# EAGLE design pm3_RF_dev (EAGLE 5.11)

## Sheet 1 of 4
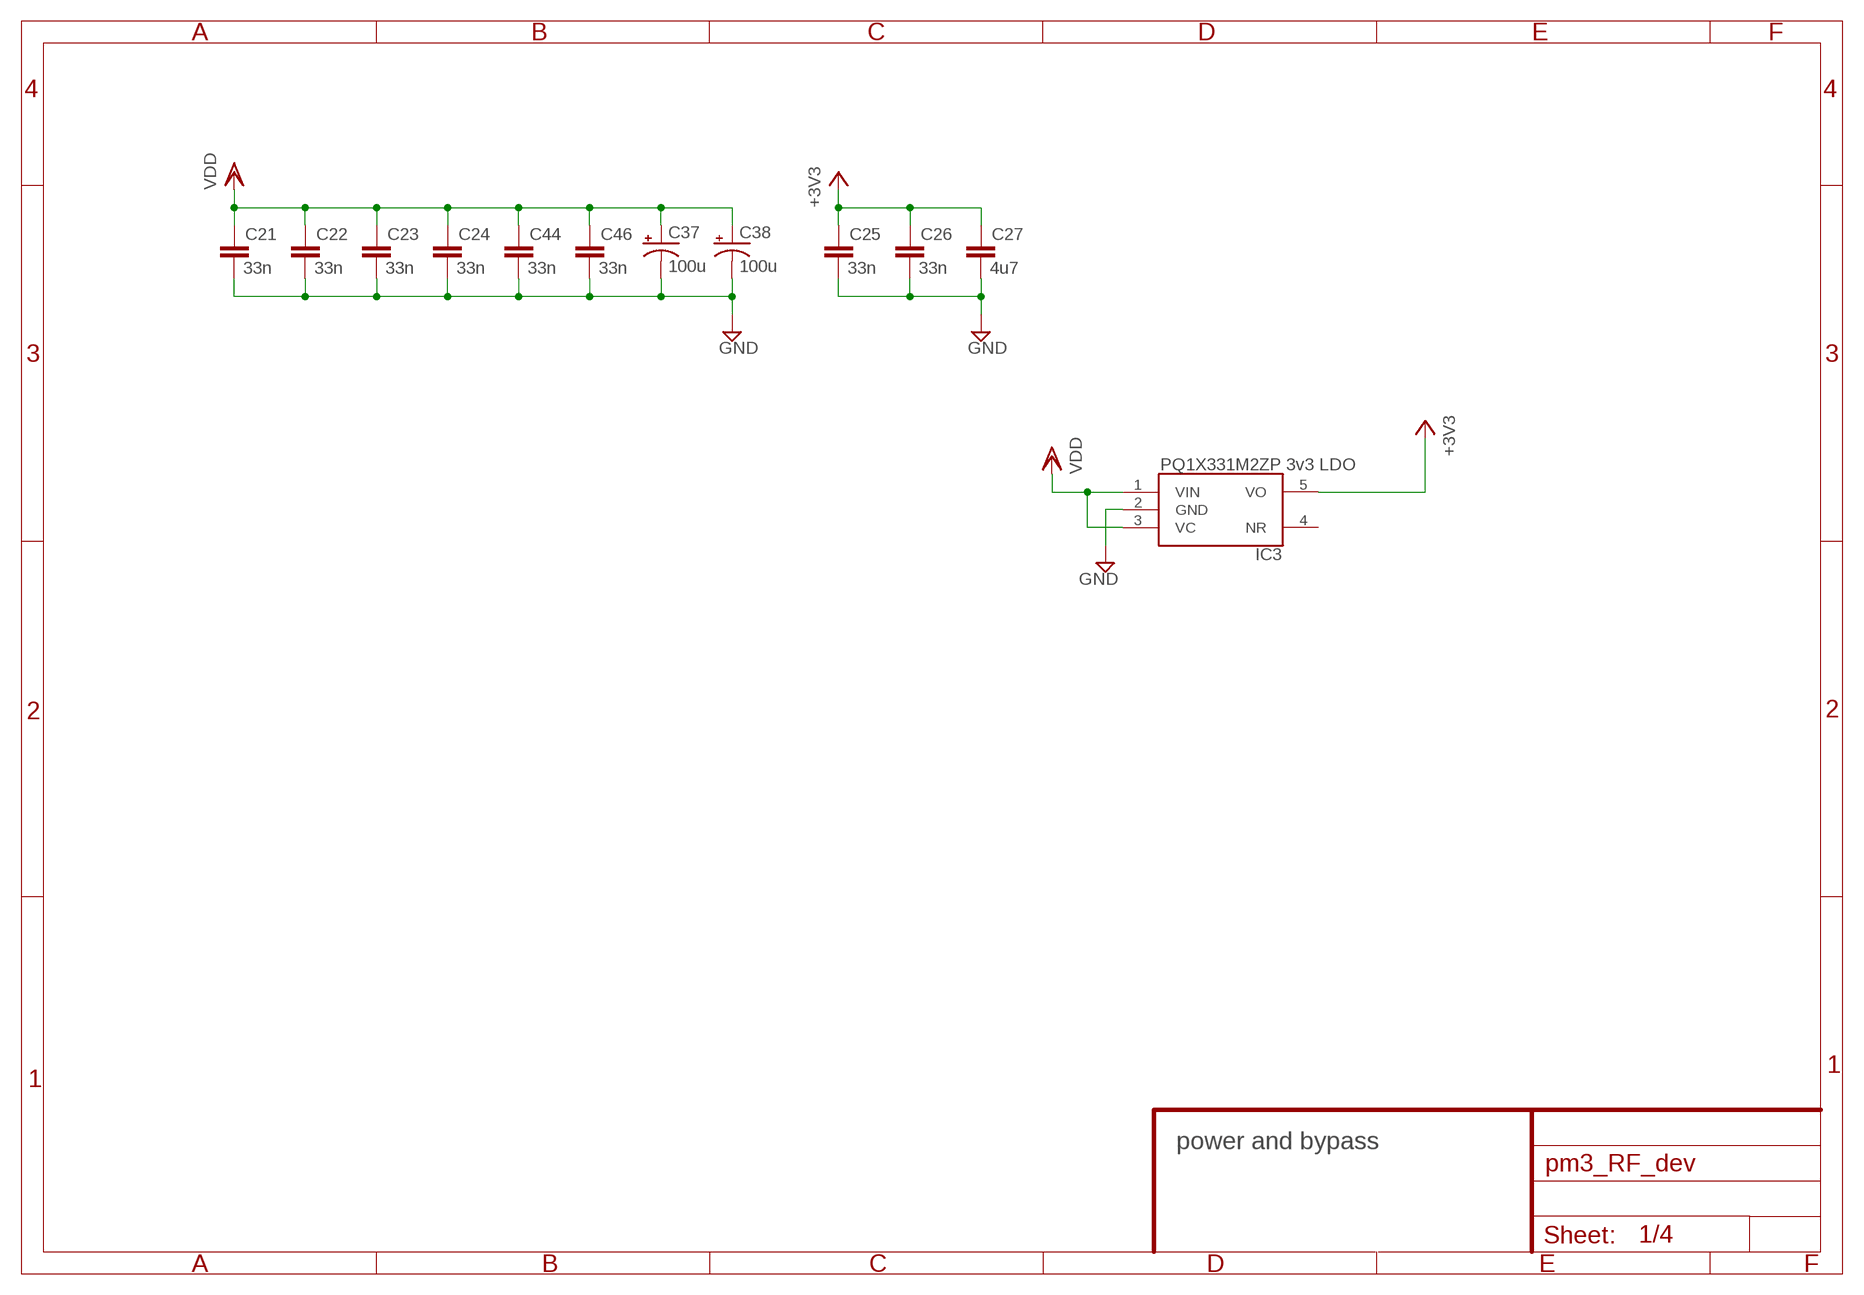
[diagram p0: schematic, sheet 1]

### Parts
C21  33n  CAPACITOR0603  [RLC_0603]
C22  33n  CAPACITOR0603  [RLC_0603]
C23  33n  CAPACITOR0603  [RLC_0603]
C24  33n  CAPACITOR0603  [RLC_0603]
C25  33n  CAPACITOR0603  [RLC_0603]
C26  33n  CAPACITOR0603  [RLC_0603]
C27  4u7  CAPACITOR1210  [RLC_1210]
C37  100u  CAPACITOR-POLARIZEDALCHIP-MZA-F80  [CAPCAITOR-ELECTROLYTIC-ALCHIP-MZA-F80]
C38  100u  CAPACITOR-POLARIZEDALCHIP-MZA-F80  [CAPCAITOR-ELECTROLYTIC-ALCHIP-MZA-F80]
C44  33n  CAPACITOR0603  [RLC_0603]
C46  33n  CAPACITOR0603  [RLC_0603]
IC3  PQ1X331M2ZP-3V3-LDO-SOT-23-5  [SOT-23-5]

### Nets
+3V3: C25.1 C26.1 C27.1 IC3.5(VO) ; also sheet 2
GND: C21.2 C22.2 C23.2 C24.2 C25.2 C26.2 C27.2 C37.- C38.- C44.2 C46.2 IC3.2(GND) ; also sheet 2,3,4
VDD: C21.1 C22.1 C23.1 C24.1 C37.+ C38.+ C44.1 C46.1 IC3.1(VIN) IC3.3(VC) ; also sheet 2,3,4
Unconnected: IC3.4(NR)

### Notes on the sheet
- power and bypass

## Sheet 2 of 4
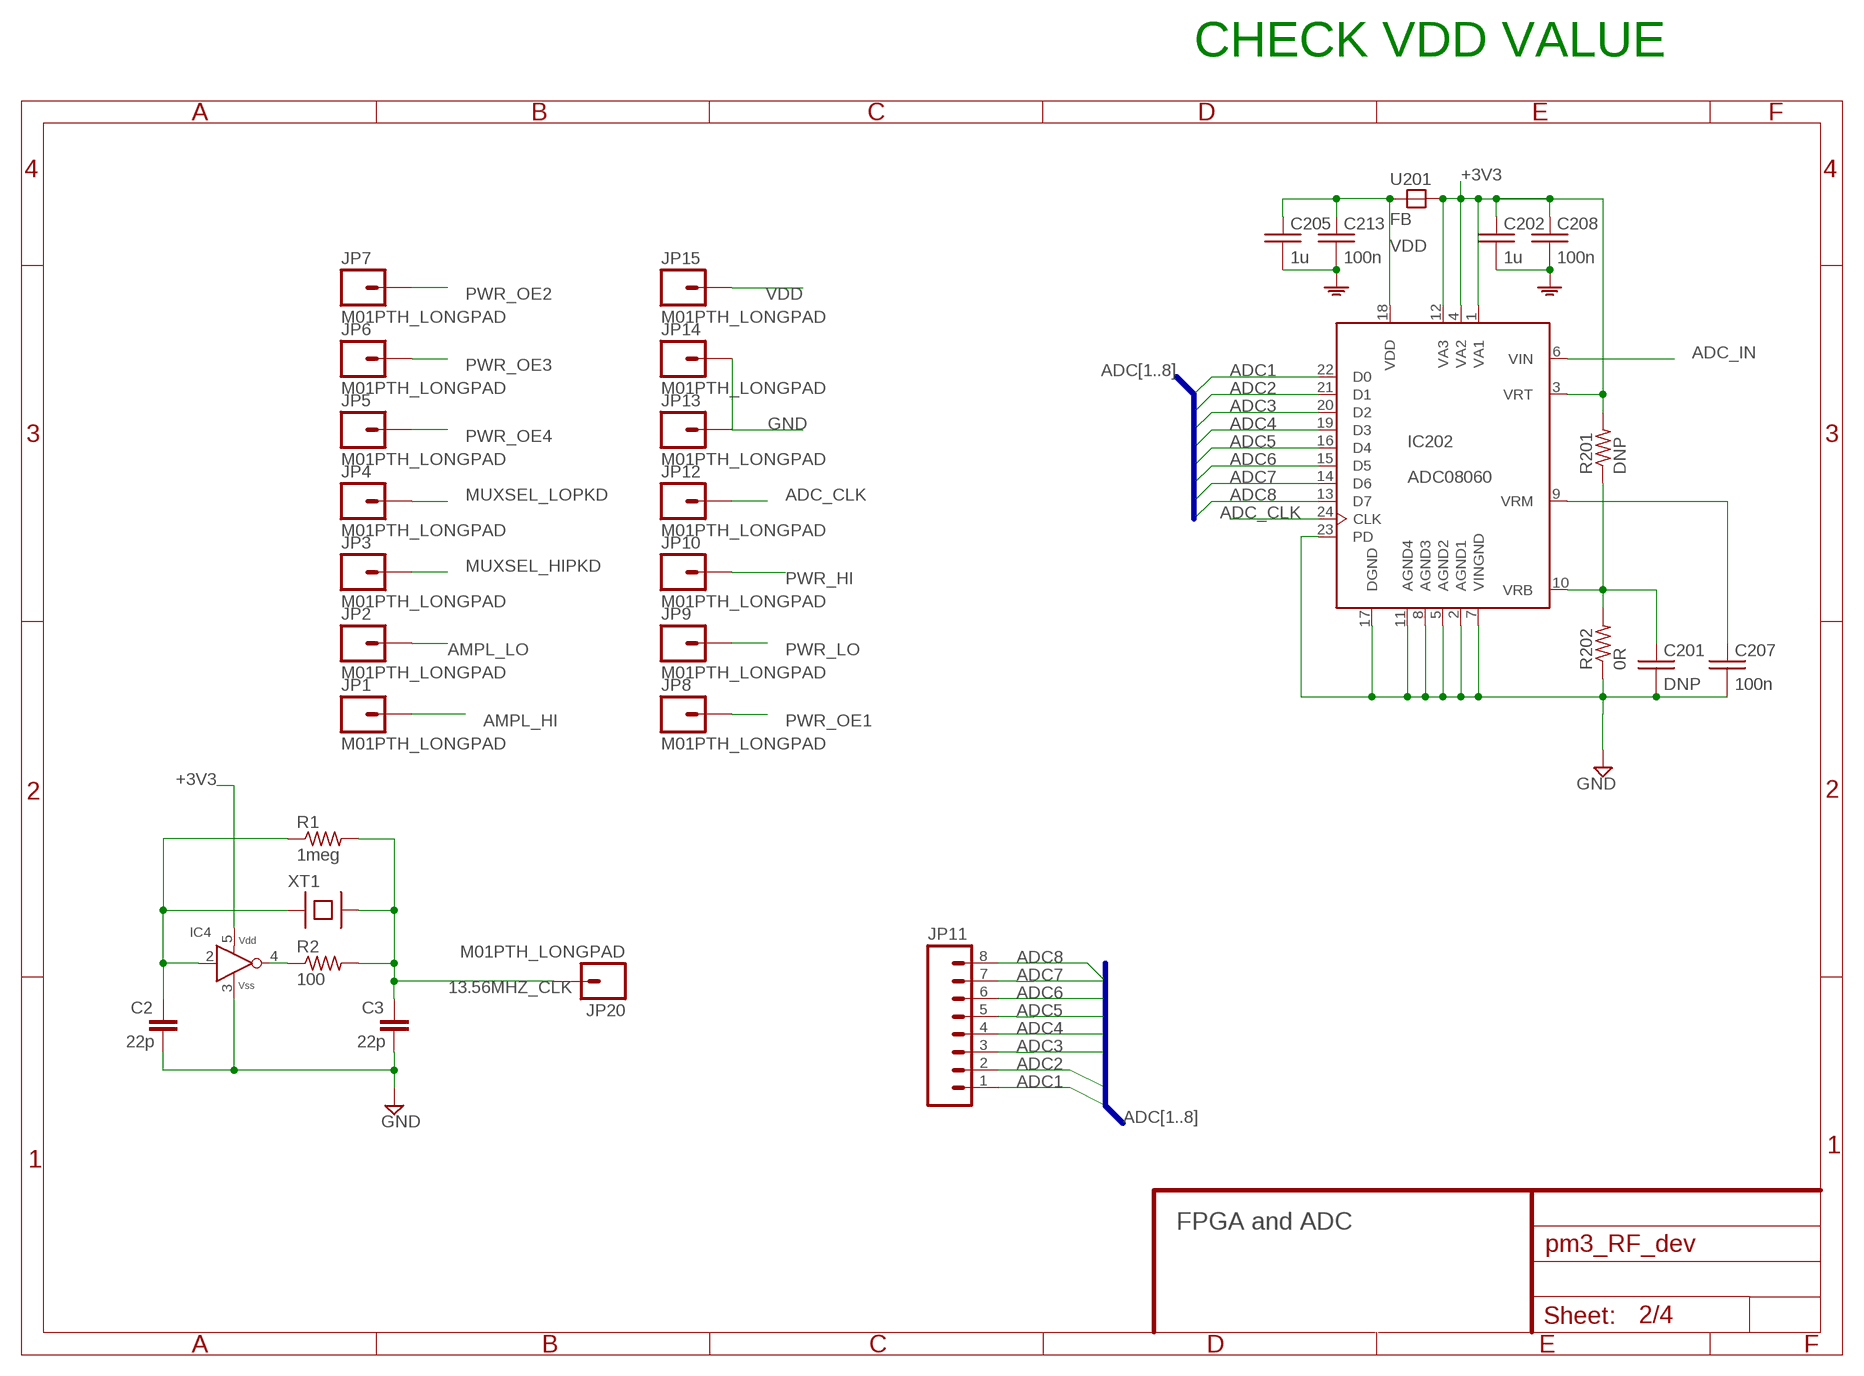
[diagram p1: schematic, sheet 2]

### Parts
C2  22p  CAPACITOR0603  [RLC_0603]
C3  22p  CAPACITOR0603  [RLC_0603]
C201  DNP  C-EU  [0603]
C202  1u  C-EU  [0603]
C205  1u  C-EU  [0603]
C207  100n  C-EU  [0603]
C208  100n  C-EU  [0603]
C213  100n  C-EU  [0603]
IC4  HCU-INVERTER  [SMV-5]
IC202  ADC08060  [TSSOP24]
JP1  M01PTH_LONGPAD  [1X01_LONGPAD]
JP2  M01PTH_LONGPAD  [1X01_LONGPAD]
JP3  M01PTH_LONGPAD  [1X01_LONGPAD]
JP4  M01PTH_LONGPAD  [1X01_LONGPAD]
JP5  M01PTH_LONGPAD  [1X01_LONGPAD]
JP6  M01PTH_LONGPAD  [1X01_LONGPAD]
JP7  M01PTH_LONGPAD  [1X01_LONGPAD]
JP8  M01PTH_LONGPAD  [1X01_LONGPAD]
JP9  M01PTH_LONGPAD  [1X01_LONGPAD]
JP10  M01PTH_LONGPAD  [1X01_LONGPAD]
JP11  M08LONGPADS  [1X08_LONGPADS]
JP12  M01PTH_LONGPAD  [1X01_LONGPAD]
JP13  M01PTH_LONGPAD  [1X01_LONGPAD]
JP14  M01PTH_LONGPAD  [1X01_LONGPAD]
JP15  M01PTH_LONGPAD  [1X01_LONGPAD]
JP20  M01PTH_LONGPAD  [1X01_LONGPAD]
R1  1meg  RESISTOR0603  [RLC_0603]
R2  100  RESISTOR0603  [RLC_0603]
R201  DNP  R-US  [0603]
R202  0R  R-US  [0603]
U201  FB  [0805]
XT1  XTAL-SMD-CITIZEN-CS10  [XTAL-SMD-CITIZEN-CS10]

### Nets
13.56MHZ_CLK: C3.1 JP20.1 R1.2 R2.2 XT1.B
+3V3: C202.1 C208.1 IC4.5(VDD) IC202.1(VA1) IC202.3(VRT) IC202.4(VA2) IC202.12(VA3) R201.2 U201.2(B) ; also sheet 1
ADC1: IC202.22(D0) JP11.1
ADC2: IC202.21(D1) JP11.2
ADC3: IC202.20(D2) JP11.3
ADC4: IC202.19(D3) JP11.4
ADC5: IC202.16(D4) JP11.5
ADC6: IC202.15(D5) JP11.6
ADC7: IC202.14(D6) JP11.7
ADC8: IC202.13(D7) JP11.8
ADC_CLK: IC202.24(CLK) JP12.1
ADC_IN: IC202.6(VIN) ; also sheet 3
AMPL_HI: JP1.1 ; also sheet 3
AMPL_LO: JP2.1 ; also sheet 3
GND: C2.2 C3.2 C202.2 C205.2 C208.2 C213.2 IC4.3(VSS) JP13.1 JP14.1 ; supply symbol labelled AGND ; also sheet 1,3,4
MUXSEL_HIPKD: JP3.1 ; also sheet 3
MUXSEL_LOPKD: JP4.1 ; also sheet 3
N$3: IC4.4(Y) R2.1
N$4: C2.1 IC4.2(A) R1.1 XT1.A
N$23: C201.1 IC202.10(VRB) R201.1 R202.2
N$24: C201.2 C207.2 IC202.2(AGND1) IC202.5(AGND2) IC202.7(VINGND) IC202.8(AGND3) IC202.11(AGND4) IC202.17(DGND) IC202.23(PD) R202.1
N$26: C207.1 IC202.9(VRM)
PWR_HI: JP10.1 ; also sheet 4
PWR_LO: JP9.1 ; also sheet 4
PWR_OE1: JP8.1 ; also sheet 4
PWR_OE2: JP7.1 ; also sheet 4
PWR_OE3: JP6.1 ; also sheet 4
PWR_OE4: JP5.1 ; also sheet 4
VDD: C205.1 C213.1 IC202.18(VDD) JP15.1 U201.1(A) ; also sheet 1,3,4

### Buses
ADC[1..8]

### Notes on the sheet
- CHECK VDD VALUE
- FPGA and ADC

## Sheet 3 of 4
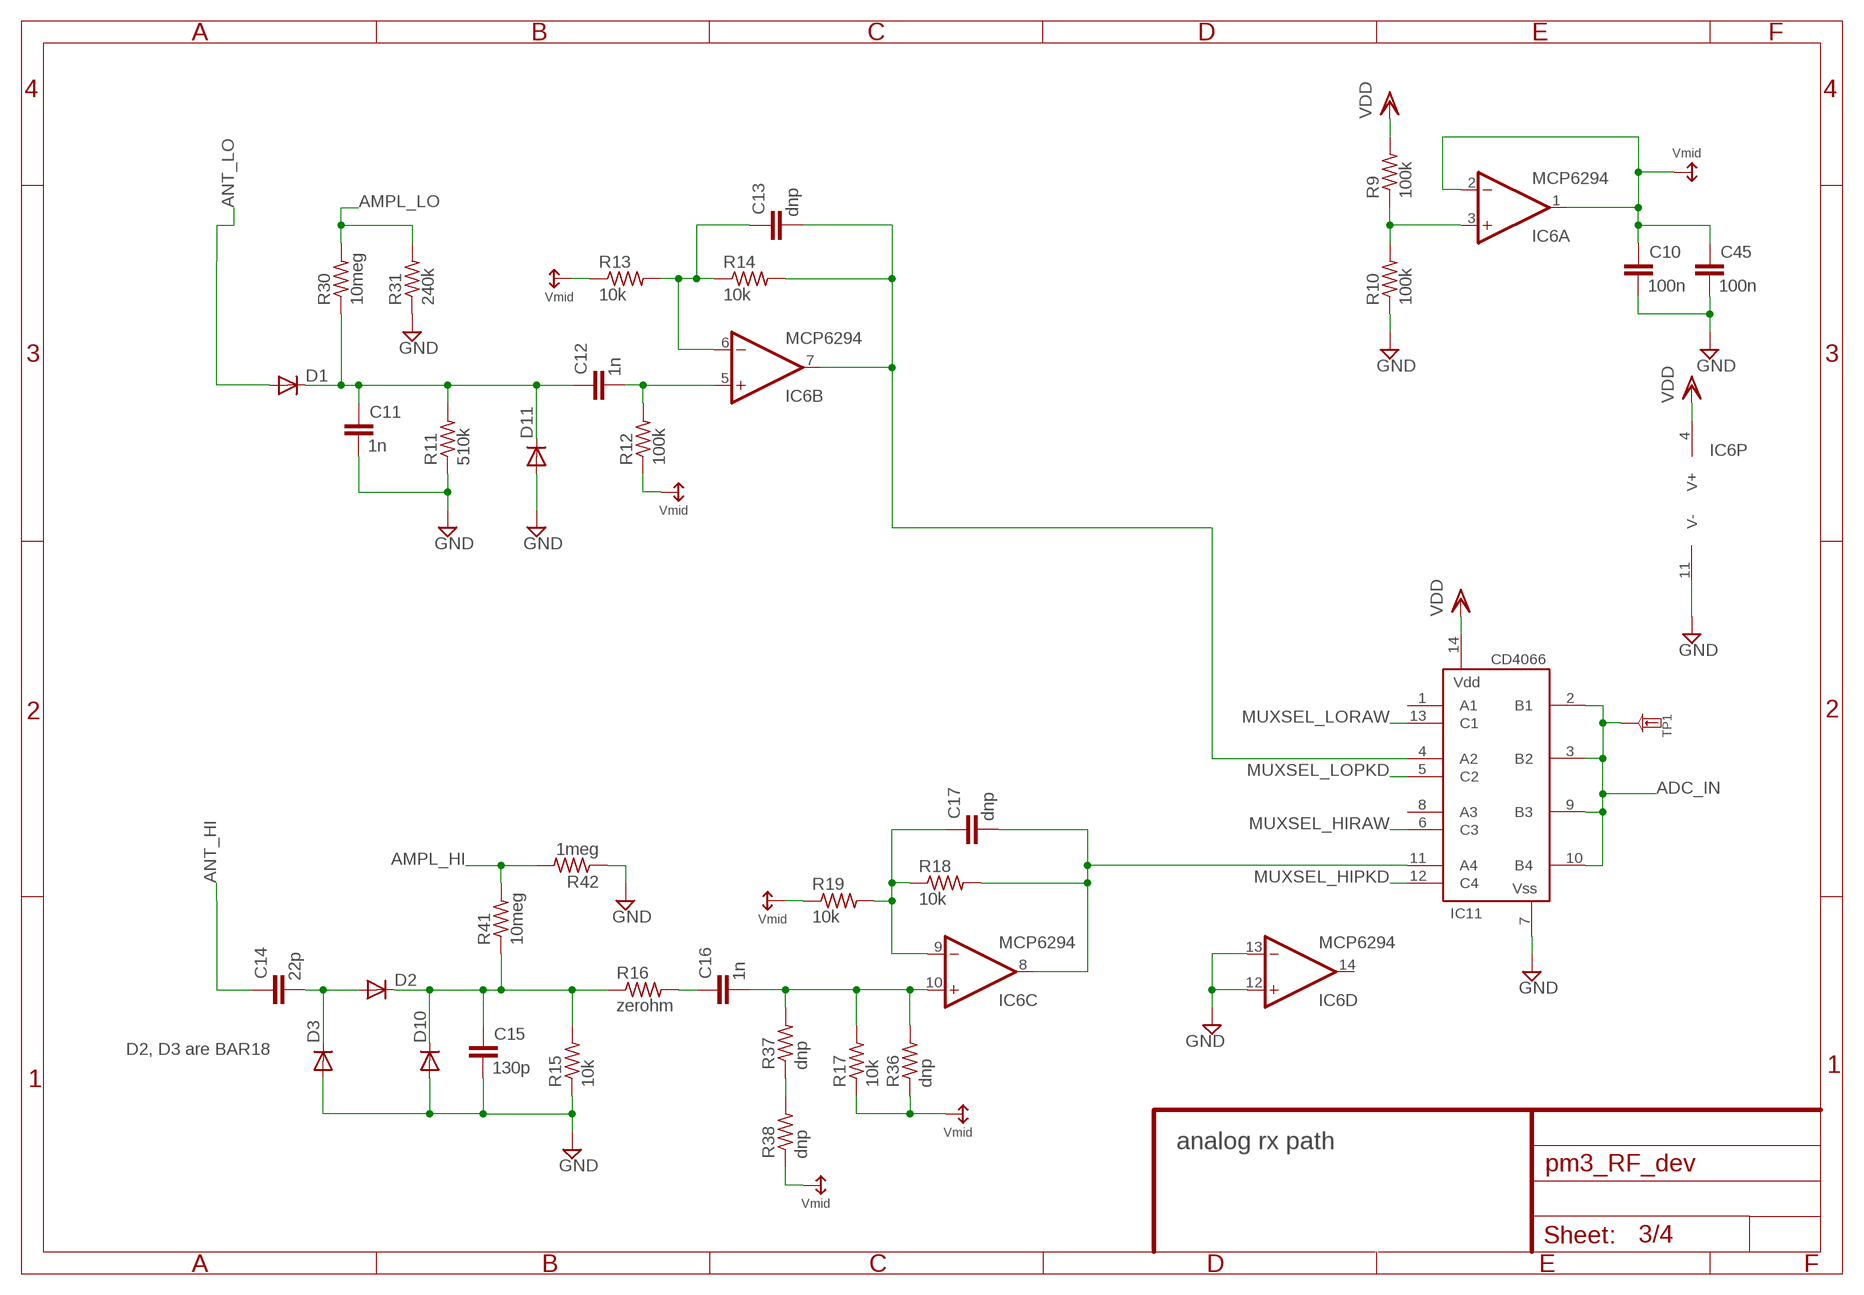
[diagram p2: schematic, sheet 3]

### Parts
C10  100n  CAPACITOR0603  [RLC_0603]
C11  1n  CAPACITOR0603  [RLC_0603]
C12  1n  CAPACITOR0603  [RLC_0603]
C13  dnp  CAPACITOR0603  [RLC_0603]
C14  22p  CAPACITOR0603  [RLC_0603]
C15  130p  CAPACITOR0603  [RLC_0603]
C16  1n  CAPACITOR0603  [RLC_0603]
C17  dnp  CAPACITOR0603  [RLC_0603]
C45  100n  CAPACITOR0603  [RLC_0603]
D1  DIODE-SMD-SOT23  [SOT23-3LEAD]
D2  DIODE-SMD-SOT23  [SOT23-3LEAD]
D3  DIODE-SMD-SOT23  [SOT23-3LEAD]
D10  DIODE-SMD-SOT23  [SOT23-3LEAD]
D11  DIODE-SMD-SOT23  [SOT23-3LEAD]
IC6  MCP6294  OPAMP-TLC2274  [TSSOP-14]
IC11  CD4066  [TSSOP-14]
R9  100k  RESISTOR0603  [RLC_0603]
R10  100k  RESISTOR0603  [RLC_0603]
R11  510k  RESISTOR0603  [RLC_0603]
R12  100k  RESISTOR0603  [RLC_0603]
R13  10k  RESISTOR0603  [RLC_0603]
R14  10k  RESISTOR0603  [RLC_0603]
R15  10k  RESISTOR0603  [RLC_0603]
R16  zerohm  RESISTOR0603  [RLC_0603]
R17  10k  RESISTOR0603  [RLC_0603]
R18  10k  RESISTOR0603  [RLC_0603]
R19  10k  RESISTOR0603  [RLC_0603]
R30  10meg  RESISTOR0603  [RLC_0603]
R31  240k  RESISTOR0603  [RLC_0603]
R36  dnp  RESISTOR0603  [RLC_0603]
R37  dnp  RESISTOR0603  [RLC_0603]
R38  dnp  RESISTOR0603  [RLC_0603]
R41  10meg  RESISTOR0603  [RLC_0603]
R42  1meg  RESISTOR0603  [RLC_0603]
TP1  TESTPADKEYSTONE-SMD  [KEYSTONE-SMD-TESTPOINT-5015]

### Nets
ADC_IN: IC11.2(B1) IC11.3(B2) IC11.9(B3) IC11.10(B4) TP1.1 ; also sheet 2
ADCDR_HI: C17.2 IC6.8(C:OUT) IC11.11(A4) R18.2
ADCDR_LO: C13.2 IC6.7(B:OUT) IC11.4(A2) R14.2
AMPL_HI: R41.2 R42.2 ; also sheet 2
AMPL_LO: R30.2 R31.2 ; also sheet 2
ANT_HI: C14.1 ; also sheet 4
ANT_LO: D1.1(A) ; also sheet 4
GND: C10.2 C11.2 C15.2 C45.2 D3.1(A) D10.1(A) D11.1(A) IC6.11(P:V-) IC6.12(D:+IN) IC6.13(D:-IN) IC11.7(VSS) R10.1 R11.1 R15.1 R31.1 R42.1 ; also sheet 1,2,4
MUXSEL_HIPKD: IC11.12(C4) ; also sheet 2
MUXSEL_HIRAW: IC11.6(C3)
MUXSEL_LOPKD: IC11.5(C2) ; also sheet 2
MUXSEL_LORAW: IC11.13(C1)
N$14: IC6.3(A:+IN) R9.1 R10.2
N$15: C17.1 IC6.9(C:-IN) R18.1 R19.2
N$16: C12.2 IC6.5(B:+IN) R12.2
N$17: C13.1 IC6.6(B:-IN) R13.2 R14.1
N$18: C16.1 R16.2
N$19: C11.1 C12.1 D1.3(C) D11.3(C) R11.2 R30.1
N$20: C14.2 D2.1(A) D3.3(C)
N$21: C15.1 D2.3(C) D10.3(C) R15.2 R16.1 R41.1
N$22: C16.2 IC6.10(C:+IN) R17.2 R36.2 R37.2
N$56: R37.1 R38.2
VDD: IC6.4(P:V+) IC11.14(VDD) R9.2 ; also sheet 1,2,4
VMID: C10.1 C45.1 IC6.1(A:OUT) IC6.2(A:-IN) R12.1 R13.1 R17.1 R19.1 R36.1 R38.1 ; supply symbol labelled SUPPLY_VMID
Unconnected: IC6.14(D:OUT) IC11.1(A1) IC11.8(A3)

### Notes on the sheet
- D2, D3 are BAR18
- analog rx path

## Sheet 4 of 4
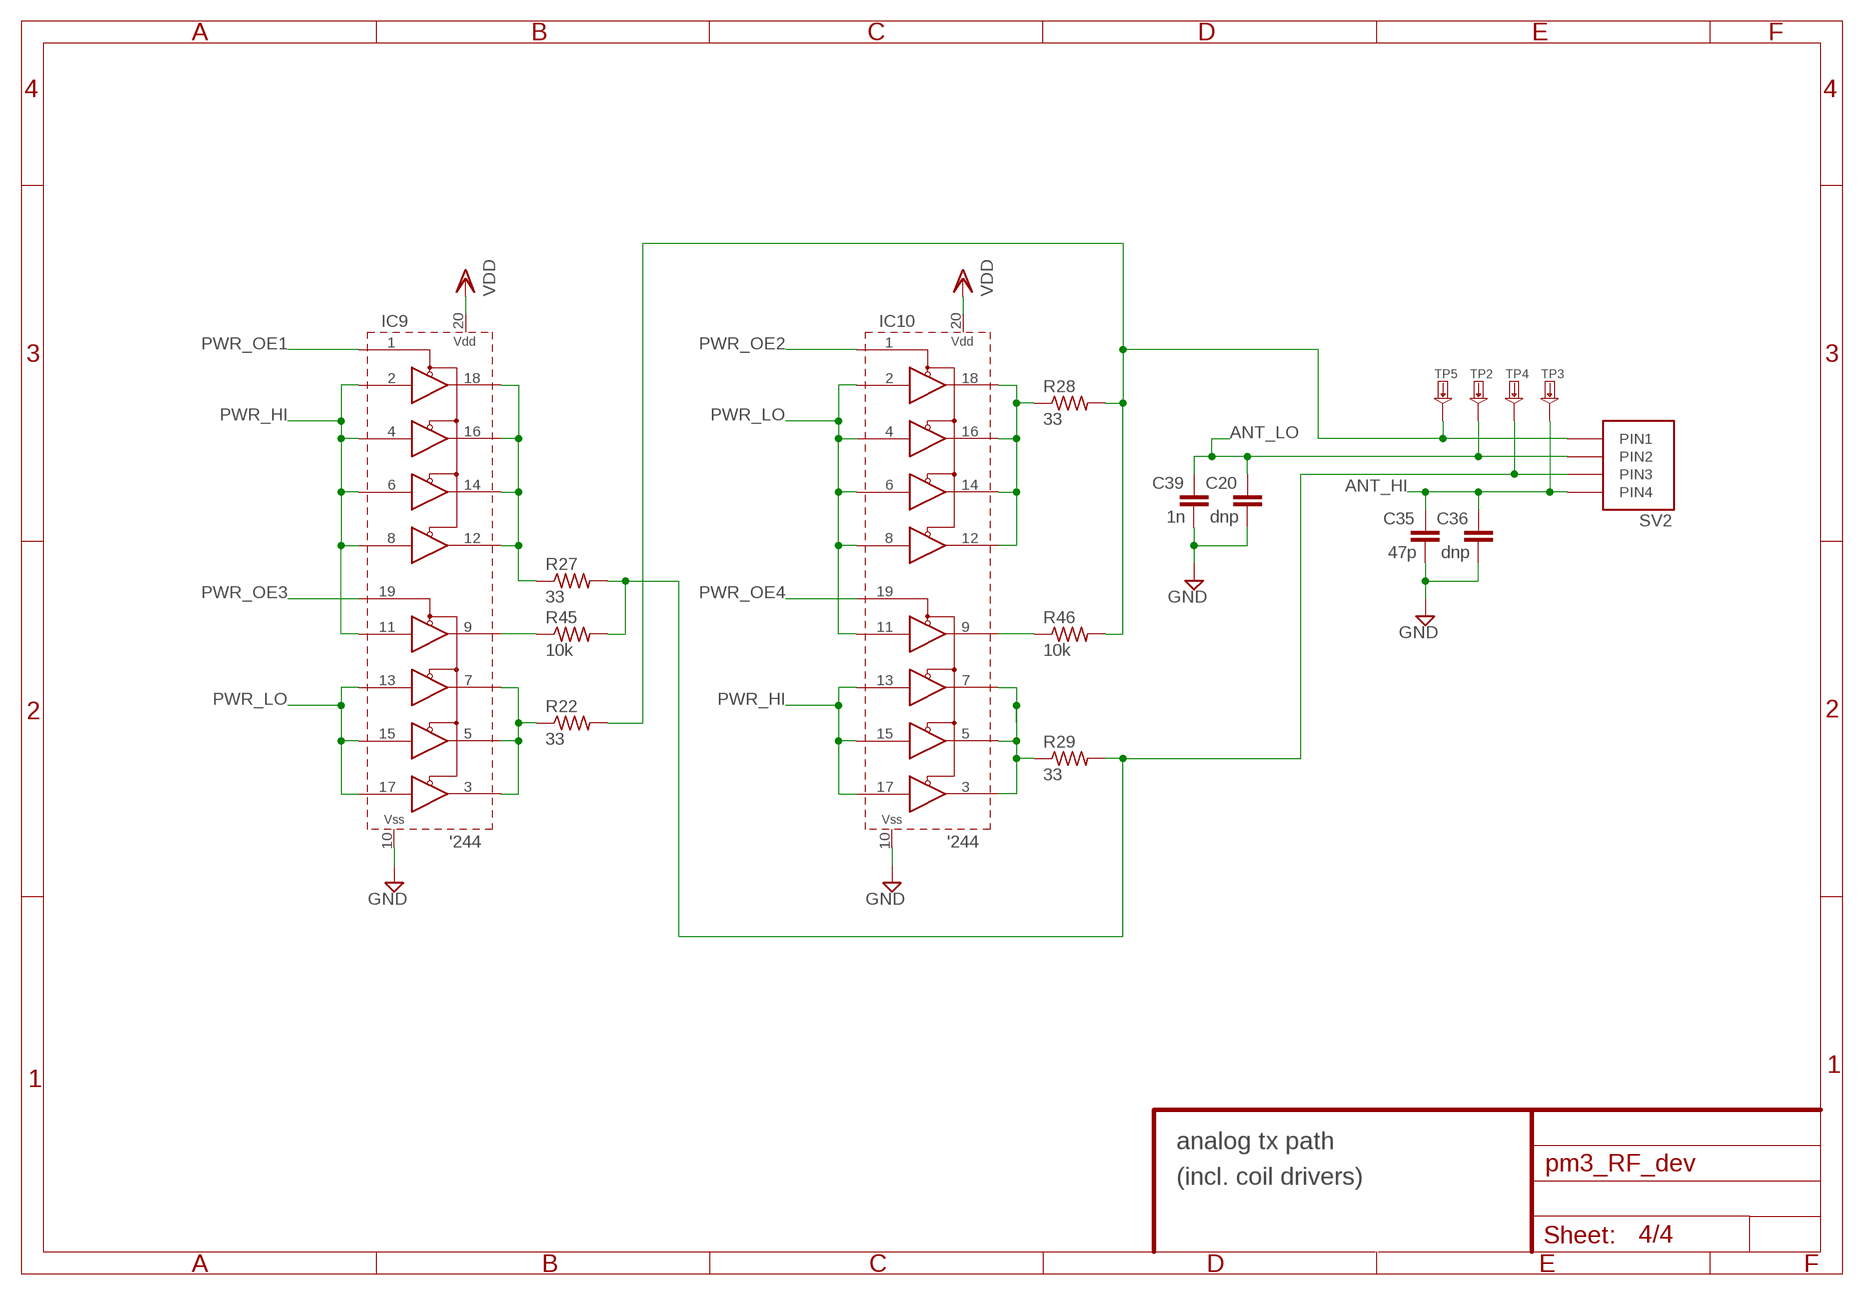
[diagram p3: schematic, sheet 4]

### Parts
C20  dnp  CAPACITOR0603  [RLC_0603]
C35  47p  CAPACITOR0603  [RLC_0603]
C36  dnp  CAPACITOR0603  [RLC_0603]
C39  1n  CAPACITOR0603  [RLC_0603]
IC9  74XX244-OCTAL-TRISTATE-BUFFERS  [TSSOP-20]
IC10  74XX244-OCTAL-TRISTATE-BUFFERS  [TSSOP-20]
R22  33  RESISTOR0603  [RLC_0603]
R27  33  RESISTOR0603  [RLC_0603]
R28  33  RESISTOR0603  [RLC_0603]
R29  33  RESISTOR0603  [RLC_0603]
R45  10k  RESISTOR0603  [RLC_0603]
R46  10k  RESISTOR0603  [RLC_0603]
SV2  HIROSE-MQ172-4POS  [HIROSE-MQ172-4POS]
TP2  TESTPADKEYSTONE-SMD  [KEYSTONE-SMD-TESTPOINT-5015]
TP3  TESTPADKEYSTONE-SMD  [KEYSTONE-SMD-TESTPOINT-5015]
TP4  TESTPADKEYSTONE-SMD  [KEYSTONE-SMD-TESTPOINT-5015]
TP5  TESTPADKEYSTONE-SMD  [KEYSTONE-SMD-TESTPOINT-5015]

### Nets
ANT_HI: C35.1 C36.1 SV2.4(PIN4) TP3.1 ; also sheet 3
ANT_LO: C20.1 C39.1 SV2.2(PIN2) TP2.1 ; also sheet 3
GND: C20.2 C35.2 C36.2 C39.2 IC9.10(VSS) IC10.10(VSS) ; also sheet 1,2,3
N$31: R27.2 R29.2 R45.2 SV2.3(PIN3) TP4.1
N$32: R22.2 R28.2 R46.2 SV2.1(PIN1) TP5.1
N$33: IC9.12(1Y4) IC9.14(1Y3) IC9.16(1Y2) IC9.18(1Y1) R27.1
N$34: IC10.12(1Y4) IC10.14(1Y3) IC10.16(1Y2) IC10.18(1Y1) R28.1
N$41: IC9.3(2Y4) IC9.5(2Y3) IC9.7(2Y2) R22.1
N$42: IC10.3(2Y4) IC10.5(2Y3) IC10.7(2Y2) R29.1
N$44: IC9.9(2Y1) R45.1
N$45: IC10.9(2Y1) R46.1
PWR_HI: IC9.2(1A1) IC9.4(1A2) IC9.6(1A3) IC9.8(1A4) IC9.11(2A1) IC10.13(2A2) IC10.15(2A3) IC10.17(2A4) ; also sheet 2
PWR_LO: IC9.13(2A2) IC9.15(2A3) IC9.17(2A4) IC10.2(1A1) IC10.4(1A2) IC10.6(1A3) IC10.8(1A4) IC10.11(2A1) ; also sheet 2
PWR_OE1: IC9.1(1NOE) ; also sheet 2
PWR_OE2: IC10.1(1NOE) ; also sheet 2
PWR_OE3: IC9.19(2NOE) ; also sheet 2
PWR_OE4: IC10.19(2NOE) ; also sheet 2
VDD: IC9.20(VDD) IC10.20(VDD) ; also sheet 1,2,3

### Notes on the sheet
- analog tx path
- (incl. coil drivers)

## Library data of the parts
C2 C3 C10-C17 C20-C27 C35 C36 C39 C44-C46 =   merged:CAPACITOR
C37 C38 =   merged:CAPACITOR-POLARIZED
C201 C202 C205 C207 C208 C213 = proxmark:C-EU: CERAMIC CHIP CAPACITOR
D1-D3 D10 D11 =   merged:DIODE-SMD-SOT23
IC3 =   merged:PQ1X331M2ZP-3V3-LDO-SOT-23-5
IC4 =   merged:HCU-INVERTER
IC6 =   merged:OPAMP-TLC2274
IC9 IC10 =   merged:74XX244-OCTAL-TRISTATE-BUFFERS
IC11 =   merged:CD4066
IC202 = proxmark:ADC08060: 8BIT A/D CONVERTER, 60MHZ Digikey part: ADC08060CIMTXCT-ND
JP1-JP10 JP12-JP15 JP20 = SparkFun:M01: Header 1 Standard 1-pin 0.1" header. Use with straight break away headers (SKU : PRT-00116), right angle break away headers (PRT-00553), swiss pins (PRT-00743), machine pins (PRT-00117), and female headers (PRT-00115).
JP11 = SparkFun:M08: Header 8 Standard 8-pin 0.1" header. Use with straight break away headers (SKU : PRT-00116), right angle break away headers (PRT-00553), swiss pins (PRT-00743), machine pins (PRT-00117), and female headers (PRT-00115).
R1 R2 R9-R19 R22 R27-R31 R36-R38 R41 R42 R45 R46 =   merged:RESISTOR
R201 R202 = proxmark:R-US: CHIP RESISTOR
SV2 =   merged:HIROSE-MQ172-4POS
TP1-TP5 =   merged:TESTPAD
U201 = proxmark:FB: FERRITE BEAD
XT1 =   merged:XTAL-SMD-CITIZEN-CS10

## Net classes
1 power: width 0.305 mm

## Board
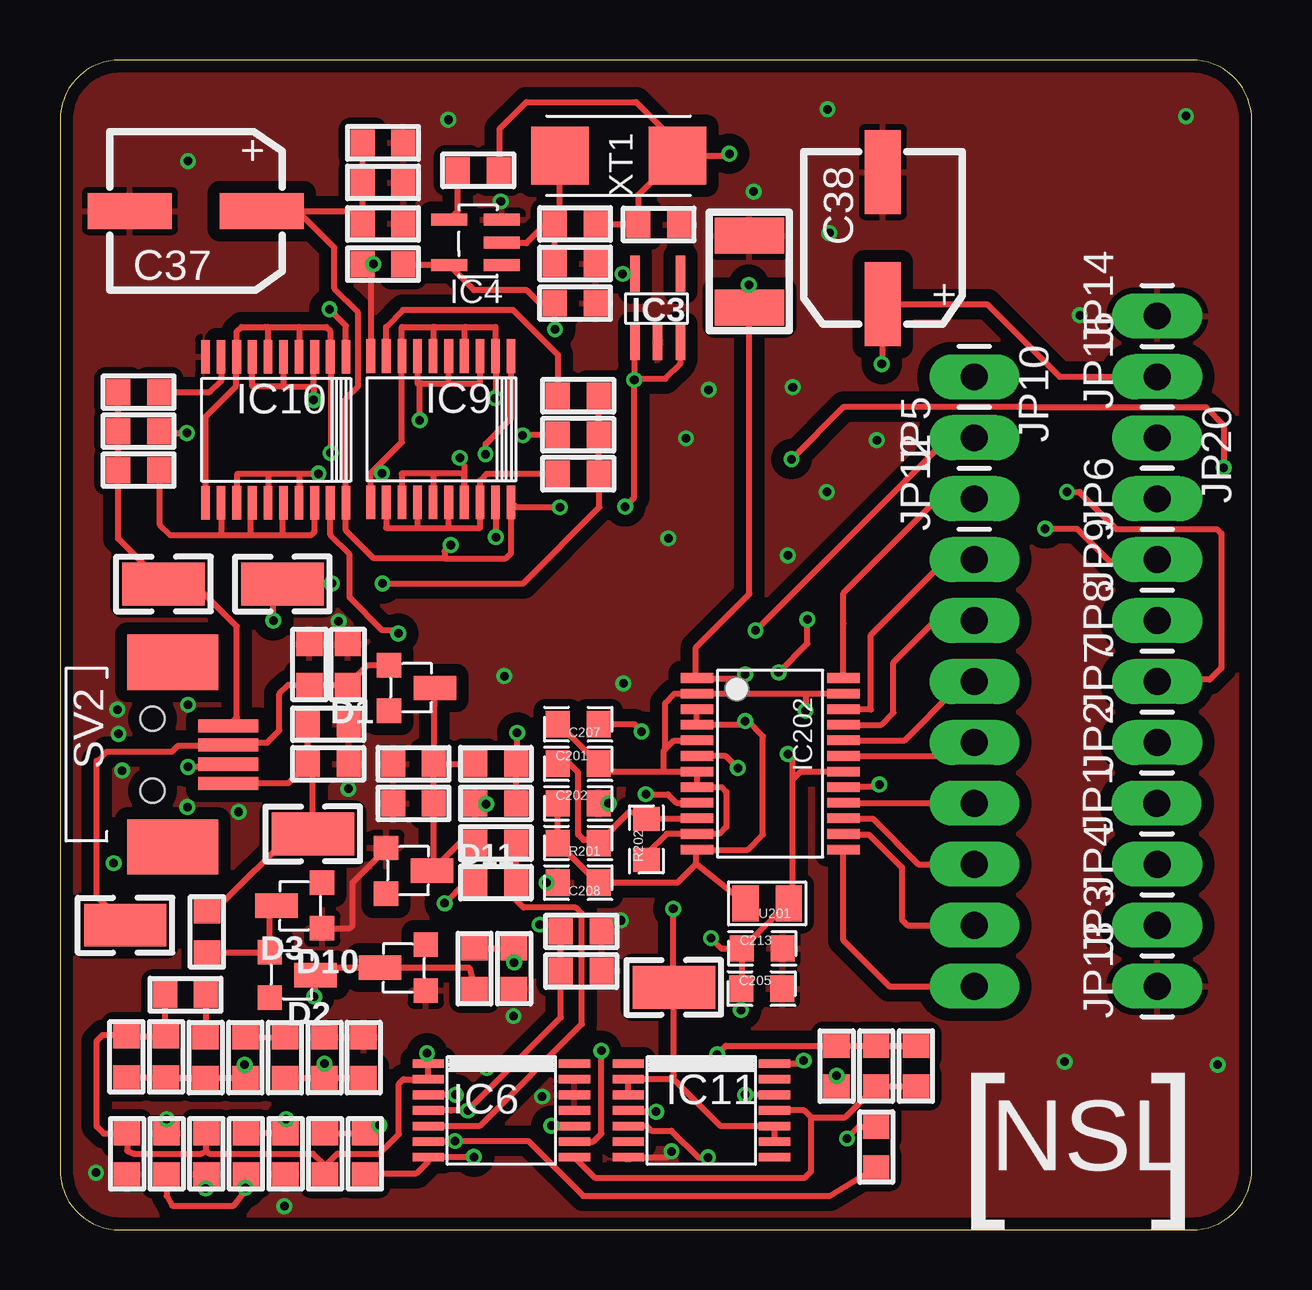
[diagram p4: board, top side]
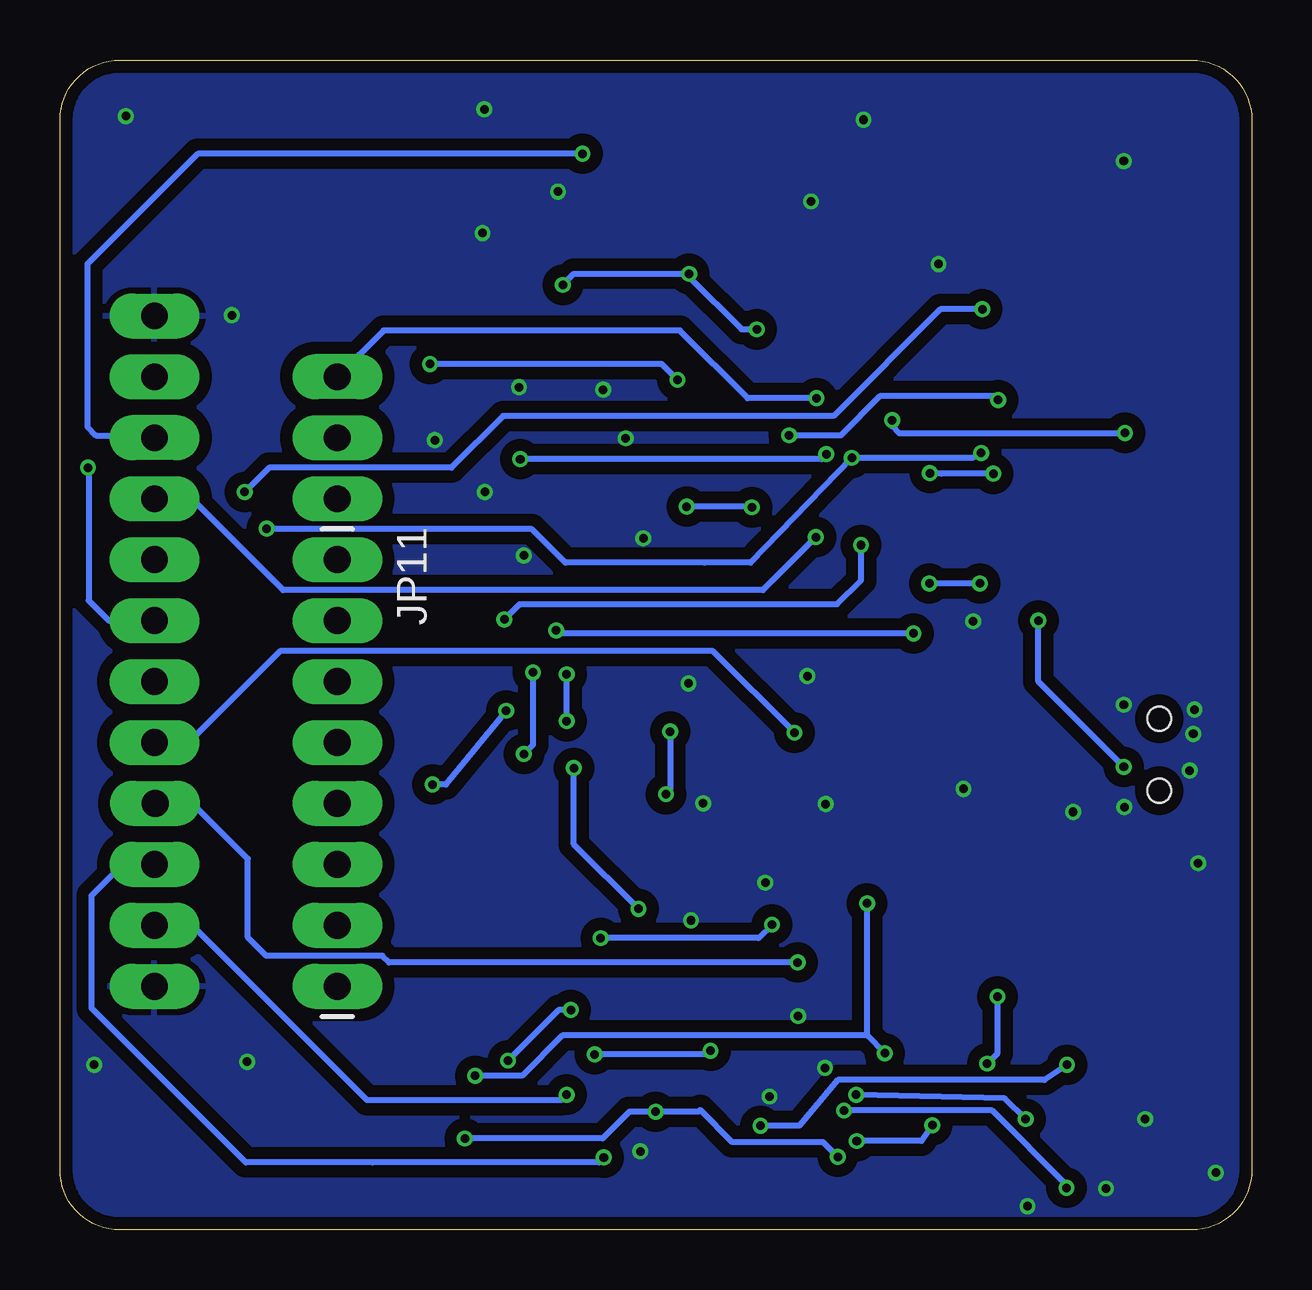
[diagram p5: board, bottom side, seen from below]

Size 49.66 x 48.77 mm. Coordinates in mm from the lower left corner, seen from the top.
Outline: 49.66,46.27 arc90 47.16,48.77 2.5,48.77 arc90 0,46.27 0,2.5 arc90 2.5,0 47.16,0 arc90 49.66,2.5 49.66,46.27
Copper layers (1*16): Top 0.035mm / dielectric 1.5mm / Bottom 0.035mm
Design rules "ITead_rule": minimum track width 6mil, minimum drill 12mil, track to track 6mil, track to pad 6mil, pad to pad 6mil, via to via 6mil, smd to smd 0mil, copper to edge 10mil, drill to drill 10mil, minimum pad ring 10mil, minimum via ring 6mil, stop-mask expansion 2mil, vias tented up to drill 100mil, thermal gap 10mil

### Footprints (pad centres in the part's own frame; a part is rotated, then mirrored left to right if it is on the bottom)
RLC_0603 = smd 1 x 1.1: 1 -0.85,0; 2 0.85,0
RLC_1210 = smd 1.5 x 2.9: 1 -1.5,0; 2 1.5,0
CAPCAITOR-ELECTROLYTIC-ALCHIP-MZA-F80 = smd 3.5 x 1.5: + 2.75,0; - -2.75,0
0603 = smd 1 x 1.1: 1 -0.85,0; 2 0.85,0
SOT23-3LEAD = smd 1.016 x 1.016: 1 -0.94,-0.762; 2 0.965,-0.762 | smd 1.016 x 1.778: 3 0.013,1.143
SOT-23-5 = smd 0.4 x 1.5: 1 -0.94,-1.422; 2 0.01,-1.422; 3 0.96,-1.422; 4 0.96,1.428; 5 -0.94,1.428
SMV-5 = smd 1.5 x 0.5: 1 0,0; 2 0,-0.95; 3 0,-1.9; 4 2.2,-1.9; 5 2.2,0
TSSOP-14 = smd 1.3 x 0.36: 1 0,0; 2 0,-0.65; 3 0,-1.3; 4 0,-1.95; 5 0,-2.6; 6 0,-3.25; 7 0,-3.9; 8 6.095,-3.9; 9 6.095,-3.25; 10 6.095,-2.6; 11 6.095,-1.95; 12 6.095,-1.3; 13 6.095,-0.65; 14 6.095,0
TSSOP-20 = smd 1.4 x 0.36: 1 0,0; 2 0,-0.65; 3 0,-1.3; 4 0,-1.95; 5 0,-2.6; 6 0,-3.25; 7 0,-3.9; 8 0,-4.55; 9 0,-5.2; 10 0,-5.85; 11 6.095,-5.85; 12 6.095,-5.2; 13 6.095,-4.55; 14 6.095,-3.9; 15 6.095,-3.25; 16 6.095,-2.6; 17 6.095,-1.95; 18 6.095,-1.3; 19 6.095,-0.65; 20 6.095,0
TSSOP24 = smd 0.4 x 1.35: 1 -3.575,-3.05; 2 -2.925,-3.05; 3 -2.275,-3.05; 4 -1.625,-3.05; 5 -0.975,-3.05; 6 -0.325,-3.05; 7 0.325,-3.05; 8 0.975,-3.05; 9 1.625,-3.05; 10 2.275,-3.05; 11 2.925,-3.05; 12 3.575,-3.05; 13 3.575,3.05; 14 2.925,3.05; 15 2.275,3.05; 16 1.625,3.05; 17 0.975,3.05; 18 0.325,3.05; 19 -0.325,3.05; 20 -0.975,3.05; 21 -1.625,3.05; 22 -2.275,3.05; 23 -2.925,3.05; 24 -3.575,3.05
1X01_LONGPAD = drill 1.118 pad 1.88 long: 1 0,0
1X08_LONGPADS = drill 1.118 pad 1.88 long: 1 0,0; 2 2.54,0; 3 5.08,0; 4 7.62,0; 5 10.16,0; 6 12.7,0; 7 15.24,0; 8 17.78,0
HIROSE-MQ172-4POS = smd 0.55 x 2.5: 1 -1.2,6.75; 2 -0.4,6.75; 3 0.4,6.75; 4 1.2,6.75 | smd 2.3 x 3.8: P$1 -3.85,4.45; P$2 3.85,4.45 | hole 1: -1.5,3.6; 1.5,3.6
KEYSTONE-SMD-TESTPOINT-5015 = smd 3.429 x 1.778: 1 0,0
0805 = smd 1.1 x 1.5: 1 -0.9,0; 2 0.9,0
XTAL-SMD-CITIZEN-CS10 = smd 2.4 x 2.4: A -0.2,0; B 4.7,0

### Placement (x,y rotation side)
C2  21.46,40.28 0 top
C3  24.94,41.91 0 top
C10  6.1,3.17 270 top
C11  14.73,19.43 180 top
C12  18.16,16.13 0 top
C13  34.01,3.45 90 top
C14  6.12,12.42 270 top
C15  12.65,7.19 90 top
C16  7.72,7.19 270 top
C17  35.66,6.83 270 top
C20  11.99,23.57 90 top
C21  4.45,3.17 90 top
C22  21.72,12.45 0 top
C23  13.46,43.66 0 top
C24  21.72,10.79 0 top
C25  13.46,40.26 180 top
C26  21.46,38.63 0 top
C27  28.73,39.95 90 top
C35  11.18,21.08 0 top
C36  11.18,19.43 0 top
C37  5.66,42.47 0 top
C38  34.29,41.35 270 top
C39  10.39,23.57 90 top
C44  13.46,41.94 0 top
C45  2.79,3.17 270 top
C46  13.46,45.31 0 top
C201  21.59,19.43 0 top
C202  21.59,17.78 0 top
C205  29.24,10.06 0 top
C207  21.59,21.08 180 top
C208  21.59,14.48 180 top
C213  29.26,11.73 0 top
D1  14.48,22.61 270 top
D2  9.5,10.64 270 top
D3  10.16,13.51 90 top
D10  14.48,10.92 90 top
D11  14.35,14.99 270 top
IC3  24.89,38.43 0 top
IC4  18.41,40.21 180 top
IC6  15.34,6.93 0 top
IC9  18.8,36.42 270 top
IC10  11.91,36.4 270 top
IC11  23.67,6.93 0 top
IC202  29.59,19.43 270 top
JP1  45.69,17.78 90 top
JP2  45.72,20.32 90 top
JP3  45.72,12.7 90 top
JP4  45.72,15.24 90 top
JP5  38.1,33.02 90 top
JP6  45.72,30.48 90 top
JP7  45.72,22.86 90 top
JP8  45.72,25.4 90 top
JP9  45.72,27.94 90 top
JP10  38.1,35.56 270 top
JP11  38.1,27.94 270 bottom
JP12  38.1,30.48 90 top
JP13  45.72,10.16 90 top
JP14  45.72,38.1 90 top
JP15  45.72,35.56 90 top
JP20  45.72,33.02 270 top
R1  21.46,41.94 0 top
R2  17.42,44.17 0 top
R9  7.75,3.17 270 top
R10  9.4,3.17 90 top
R11  14.73,17.78 0 top
R12  18.16,14.48 0 top
R13  11.05,3.17 90 top
R14  12.7,3.17 270 top
R15  11.02,7.19 270 top
R16  9.37,7.19 90 top
R17  4.42,7.21 270 top
R18  34.01,6.83 270 top
R19  32.36,6.83 90 top
R22  3.28,33.3 180 top
R27  21.59,31.52 0 top
R28  3.28,31.67 180 top
R29  21.59,33.15 0 top
R30  18.16,19.43 0 top
R31  18.16,17.78 0 top
R36  2.77,7.21 270 top
R37  6.07,7.19 270 top
R38  5.23,9.8 0 top
R41  17.27,10.9 90 top
R42  18.92,10.9 90 top
R45  21.59,34.77 0 top
R46  3.28,34.92 180 top
R201  21.59,16.13 180 top
R202  24.43,16.28 90 top
SV2  0.25,19.81 270 top
TP1  25.58,10.11 180 top
TP2  2.72,12.7 180 top
TP3  10.54,16.51 180 top
TP4  9.27,26.92 180 top
TP5  4.32,26.92 180 top
U201  29.46,13.61 180 top
XT1  21.03,44.78 0 top

### Tracks (layer width: path | path; a pad name or v marks a point on that pad's centre or on a via)
13.56MHZ_CLK  (via drill 0.36)
  Top 0.254: R1.2 22.34,41.91 C3.1 24.09,43.14 XT1.B | R2.2 18.31,44.21 18.31,45.9 19.43,47.02 24,47.02 25.73,45.29 XT1.B | v27.89,44.86 27.81,44.78 XT1.B
  Bottom 0.254: JP20.1 45.82,33.12 48.16,33.12 48.51,33.48 48.51,40.26 43.92,44.86 v27.89,44.86
+3V3  (via drill 0.36)
  Top 0.254: C202.1 R201.2 22.39,14.48 C208.1 25.73,14.48 26.52,15.27 | 26.52,15.27 26.52,15.83 IC202.12 28.65,15.85 29.29,16.48 29.29,20.57 28.65,21.21 v28.55,21.21 28.4,21.06 IC202.4 IC202.3 | 26.52,15.27 U201.2 | v28.55,23.16 arc-90 28.35,22.96 26.59,22.96 IC202.1 26.49,23.05 26.49,24.28 28.73,26.52 C27.1 28.7,38.48 v28.7,39.4 | C25.1 14.36,40.21 IC4.5 17.26,39.17 19.46,39.17 19.99,38.63 C26.1 20.61,37.55 v20.62,37.54 | v23.44,39.85 v23.45,39.86 IC3.5
  Bottom 0.254: v28.55,23.16 28.55,22.91 v28.55,21.21 | v20.62,37.54 21.26,37.54 23.44,39.73 v23.44,39.85 28.25,39.85 v28.7,39.4
ADC1
  Top 0.254: IC202.22 33.77,21.71 33.78,21.69 33.78,24.79 36.93,27.94 JP11.1
ADC2
  Top 0.254: IC202.21 34.21,21.06 34.72,21.57 34.72,23.65 36.47,25.4 JP11.2
ADC3
  Top 0.254: IC202.20 35.19,20.41 37.26,22.48 37.72,22.48 JP11.3
ADC4
  Top 0.254: IC202.19 37.54,19.76 JP11.4
ADC5
  Top 0.254: IC202.16 38.07,17.81 arc-90 JP11.5
ADC6
  Top 0.254: IC202.15 32.65,17.14 33.55,17.14 33.86,17.14 35.76,15.24 JP11.6
ADC7
  Top 0.254: IC202.14 32.66,16.48 33.71,16.48 35.08,15.11 35.08,12.93 35.31,12.7 JP11.7
ADC8
  Top 0.254: IC202.13 32.64,12.06 34.54,10.16 JP11.8
ADC_CLK
  Top 0.254: IC202.24 32.64,25.27 32.64,26.54 36.58,30.48 JP12.1
ADC_IN  (via drill 0.36)
  Top 0.254: IC11.9 IC11.10 27.52,4.33 25.55,6.3 25.45,6.3 | IC11.3 IC11.2 23.69,6.3 25.45,6.3 | 25.45,6.3 25.58,6.43 TP1.1 25.55,10.13 v25.55,13.39 | v28.25,19.25 27.74,19.76 IC202.6
  Bottom 0.254: v25.55,13.39 28.25,16.08 v28.25,19.25
ADCDR_HI
  Top 0.254: IC6.8 22.29,2.18 31.04,2.18 31.29,2.44 31.29,4.7 | 31.29,4.7 31.01,4.98 IC11.11 | 31.29,4.7 32.73,4.7 R18.2 C17.2
ADCDR_LO  (via drill 0.36)
  Top 0.254: R14.2 12.74,2.36 14.86,2.36 15.34,2.85 IC6.7 15.36,3.05 v17.25,3.05 | v32.79,3.81 33.29,4.3 C13.2 | IC11.4 23.73,4.93 v24.84,4.93
  Bottom 0.254: v17.25,3.05 17.86,3.66 21.64,3.66 22.99,5 23.06,4.93 v24.84,4.93 | v32.79,3.81 27.05,3.81 25.93,4.93 25.25,4.93 | v24.84,4.93 25.25,4.93 | v24.84,4.93 25.25,4.93
AMPL_HI  (via drill 0.36)
  Top 0.254: R41.2 R42.2 v18.92,11.15
  Bottom 0.254: v18.92,11.15 35.94,11.15 36.22,11.43 41.07,11.43 41.83,12.19 41.83,15.47 44.17,17.8 45.67,17.8 JP1.1
AMPL_LO  (via drill 0.36)
  Top 0.254: R31.2 R30.2 19.05,19.47 v19.05,20.73
  Bottom 0.254: v19.05,20.73 22.45,24.13 40.49,24.13 44.3,20.32 JP2.1
ANT_HI
  Top 0.254: SV2.4 9.51,18.61 C36.1 | C36.1 10.54,19.22 TP3.1 10.29,16.76 9.91,16.76 6.41,13.27 C14.1 | C36.1 C35.1
ANT_LO
  Top 0.254: TP2.1 1.52,13.89 1.52,19.56 1.57,19.56 1.96,19.94 4.67,19.94 4.93,20.19 6.96,20.19 arc45 SV2.2 7.11,20.32 8.64,20.32 9.14,20.83 9.14,22.35 9.51,22.72 C39.1 C20.1 12.81,23.55 D1.1
GND  (via drill 0.36)
  Top 0.254: D11.1 13.59,15.88 12.7,14.99 12.19,14.48 12.19,12.95 12.19,12.7 12.06,12.57 D3.1 | IC11.7 23.68,3.02 25.3,3.02 | C25.2 12.95,39.92 IC9.10
  other vias: 6.07,1.73 1.5,2.39 4.45,4.62 25.48,3.28 20.09,5.56 17.78,6.76 18.9,8.92 20.27,14.48 17.75,17.75 22.86,17.78 23.37,12.9 12.01,18.39 13.06,40.26 18.36,42.88 11.61,25.37 9.35,0.99 2.39,21.69 5.33,21.89 2.59,19.15 5.31,17.63 7.44,17.42 2.24,15.29 2.44,20.68 18.52,23.09 23.47,22.78 25.35,28.83 26.09,32.99 27.03,35.03 28.91,43.28 16.18,46.28 5.33,44.55 30.53,35.13 34.04,32.92 31.95,30.76 30.33,28.12 42.49,38.13 32.05,41.55 31.98,46.71 46.91,46.43 41.86,7.01 48.23,6.88
  pour Top (isolate 0.508): -1.19,49.66 -1.42,-0.76 50.9,-0.38 50.9,49.66
  pour Bottom (isolate 0.508): -1.04,49.5 -0.81,-0.69 50.7,-0.81 51.23,49.17
MUXSEL_HIPKD  (via drill 0.36)
  Top 0.254: IC11.12 v28.55,5.64
  Bottom 0.254: v28.55,5.64 28.78,5.41 36.85,5.41 44.15,12.7 JP3.1
MUXSEL_LOPKD  (via drill 0.36)
  Top 0.254: IC11.5 23.68,4.34 24.43,4.34 24.64,4.14 25.48,4.14 26.59,3.02 v27,3.02
  Bottom 0.254: v27,3.02 27.2,2.82 36.63,2.82 41.91,2.82 48.34,9.25 48.34,13.95 46.97,15.32 45.8,15.32 JP4.1
N$3
  Top 0.254: IC4.4 16.57,42.47 R2.1
N$4
  Top 0.254: IC4.2 18.45,41.12 19.43,41.12 20.24,41.94 R1.1 | C2.1 R1.1 | R1.1 20.83,42.15 XT1.A
N$14  (via drill 0.36)
  Top 0.254: R9.1 R10.2 9.42,4.05 v9.42,4.62 | v16.48,5.64 v16.48,5.63 IC6.3
  Bottom 0.254: v9.42,4.62 10.29,5.49 v16.48,5.64
N$15  (via drill 0.36)
  Top 0.254: C17.1 R18.1 R19.2 27.75,7.68 v27.38,7.32 | IC6.9 22.23,3.68 22.55,4.01 v22.55,7.47
  Bottom 0.254: v22.55,7.47 arc90 22.71,7.32 v27.38,7.32
N$16
  Top 0.254: IC6.5 15.35,4.34 17.5,4.34 21.74,8.59 21.74,13.18 21.49,13.44 19.3,13.44 19.01,13.73 R12.2 C12.2
N$17  (via drill 0.36)
  Top 0.254: R13.2 R14.1 12.74,4.06 v13.31,4.37 | IC6.6 16.43,3.68 v16.46,3.71 19.51,3.71 21.79,1.42 32.07,1.42 C13.1
  Bottom 0.254: v13.31,4.37 13.77,3.71 v16.46,3.71
N$18
  Top 0.254: C16.1 R16.2
N$19
  Top 0.254: C11.1 R11.2 15.58,15.06 D11.3 16.65,16.13 C12.1 | C11.1 R30.1 | C11.1 D1.3
N$20
  Top 0.254: C14.2 8.73,11.57 D2.1 8.74,13.25 D3.3
N$21  (via drill 0.36)
  Top 0.254: R16.1 R15.2 | R15.2 C15.1 | R15.2 v11.02,6.93 | v10.59,9.73 10.64,9.78 D2.3 10.95,10.94 D10.3 17.04,10.94 R41.1
  Bottom 0.254: v11.02,6.93 10.59,7.37 v10.59,9.73
N$22  (via drill 0.36)
  Top 0.254: R36.2 R17.2 4.45,6.34 R37.2 C16.2 7.7,6.36 v7.7,6.88 | v20.47,4.34 20.48,4.33 IC6.10
  Bottom 0.254: v7.7,6.88 8.64,6.25 17.25,6.25 18.85,4.34 v20.47,4.34
N$23
  Top 0.254: IC202.10 24.69,17.16 R202.2 23.75,17.44 R201.1 22.31,16.26 21.82,16.26 21.59,16.48 21.59,19.07 21.23,19.43 C201.1
N$24  (via drill 0.36)
  Top 0.254: R202.1 24.5,15.74 25.27,16.51 IC202.11 27.48,16.51 27.76,16.79 27.76,18.26 27.57,18.46 IC202.8 IC202.7 25.15,19.11 | C207.2 20.79,21.08 C201.2 22.77,19.11 25.15,19.11 | IC202.5 26.53,20.4 25.58,20.4 25.22,20.04 | 25.22,20.04 25.15,19.96 25.15,19.11 | 25.22,20.04 25.22,21.97 25.6,22.35 IC202.2 30.53,22.36 31.04,22.36 | 31.04,22.36 IC202.23 | IC202.17 34.03,18.46 v34.14,18.57 | v31.06,21.64 31.06,22.33 31.04,22.36
  Bottom 0.254: v34.14,18.57 33.58,18.57 v31.06,21.64
N$26  (via drill 0.36)
  Top 0.254: IC202.9 25.68,17.8 25.32,18.16 v24.41,18.16 | v24.23,20.78 23.93,21.08 C207.1
  Bottom 0.254: v24.41,18.16 24.23,18.34 v24.23,20.78
N$31  (via drill 0.36)
  Top 0.254: SV2.3 7.11,19.3 v5.33,19.3 | v8.89,25.4 8.89,26.92 TP4.1 9.3,26.95 v11.33,26.95 | v13.44,26.95 19.3,26.95 22.48,30.12 22.48,31.48 R27.2 R29.2 R45.2
  Bottom 0.254: v5.33,19.3 8.89,22.86 v8.89,25.4 | v11.33,26.95 v13.44,26.95
N$32
  Top 0.254: SV2.1 7.37,21.37 7.37,25.15 5.59,26.92 TP5.1 2.43,28.82 R28.2 R22.2 R46.2
N$33
  Top 0.254: IC9.12 13.59,29.26 14.83,29.26 | 14.83,29.26 16.2,29.26 | 16.2,29.26 17.5,29.26 IC9.18 17.5,31.24 17.78,31.52 R27.1 | IC9.14 14.9,29.26 14.83,29.26 | IC9.16 16.2,29.26
N$34
  Top 0.254: R28.1 4.17,31.64 4.17,29.39 4.6,28.96 6.73,28.96 | 6.73,28.96 7.95,28.96 | 7.95,28.96 9.27,28.96 | 9.27,28.96 10.46,28.96 10.61,29.1 IC10.18 | IC10.12 6.73,30.29 6.73,28.96 | IC10.16 9.27,30.3 9.27,28.96 | IC10.14 7.95,30.3 7.95,28.96
N$41  (via drill 0.36)
  Top 0.254: IC9.7 14.9,35.28 15.09,35.28 | 15.09,35.28 16.2,35.28 | 16.2,35.28 17.5,35.28 IC9.3 | IC9.5 16.2,35.28 | R22.1 4.2,33.22 v5.28,33.22 | v14.99,33.76 14.99,35.18 arc-90 15.09,35.28
  Bottom 0.254: v5.28,33.22 5.31,33.2 14.68,33.2 14.99,33.5 v14.99,33.76
N$42  (via drill 0.36)
  Top 0.254: IC10.7 8.01,35.15 9.25,35.15 | 9.25,35.15 10.57,35.15 | 10.57,35.15 10.57,36.4 IC10.3 | IC10.5 9.31,35.15 9.25,35.15 | R29.1 19.3,33.15 v19.28,33.12 | 10.57,35.15 v10.57,34.59
  Bottom 0.254: v19.28,33.12 17.12,33.12 15.49,34.75 10.72,34.75 v10.57,34.59
N$44
  Top 0.254: R45.1 20.74,36.49 18.87,38.35 14.3,38.35 13.59,37.64 IC9.9
N$45
  Top 0.254: R46.1 6.25,34.92 6.73,35.41 6.73,36.38 IC10.9
N$56
  Top 0.254: R37.1 6.08,8.05 R38.2
PWR_HI  (via drill 0.36)
  Top 0.254: IC10.15 8.69,30.33 8.69,31.52 | 8.69,31.52 9.96,31.52 | 9.96,31.52 IC10.17 9.96,31.52 | IC10.13 7.39,30.3 7.39,31.52 8.69,31.52 | IC9.11 12.93,30.33 12.93,31.52 13.08,31.67 | 15.62,37.64 14.25,37.64 IC9.8 14.25,32.84 13.08,31.67 | 15.62,37.64 16.92,37.64 | 16.92,37.64 18.14,37.64 18.14,36.42 IC9.2 v18.15,34.68 v18.14,34.67 | IC9.4 16.85,37.64 16.92,37.64 | IC9.6 15.55,37.64 15.62,37.64 | 9.96,31.52 v10.77,31.52 | v13.41,31.55 13.26,31.5 13.08,31.67
  Bottom 0.254: v18.14,34.67 21.01,34.67 23.82,37.49 36.17,37.49 JP10.1 | v10.77,31.52 12.93,31.52 13.61,31.52 v13.41,31.55
PWR_LO  (via drill 0.36)
  Top 0.254: IC10.11 6.06,33.9 7.34,35.18 7.34,36.38 IC10.8 7.36,37.44 7.57,37.64 8.53,37.64 | 8.53,37.64 9.98,37.64 | 9.98,37.64 11.1,37.64 11.25,37.49 IC10.2 11.28,36.38 v11.28,32.38 | IC10.6 8.66,37.64 8.53,37.64 | IC10.4 9.96,37.64 9.98,37.64 | IC9.13 14.25,31.52 14.22,31.52 15.6,31.52 | 15.6,31.52 16.84,31.52 IC9.17 16.85,31.85 v16.66,32.18 | IC9.15 15.55,31.52 15.6,31.52 | JP9.1 45.67,27.89 43.71,27.89 42.37,29.23 v41.05,29.23
  Bottom 0.254: v11.28,32.38 11.63,32.18 v16.66,32.18 20.88,27.81 22.81,27.81 28.6,27.81 30,29.21 41.02,29.21 v41.05,29.23
PWR_OE1  (via drill 0.36)
  Top 0.254: IC9.1 18.8,33.83 17.73,32.77 v17.73,32.33 | v30.48,32.13 32.66,34.31 40.64,34.31 40.66,34.29 47.75,34.29 48.49,33.55 v48.49,31.77
  Bottom 0.254: v17.73,32.33 17.93,32.13 v30.48,32.13 | v48.49,31.77 48.46,31.75 48.46,26.24 47.62,25.4 JP8.1
PWR_OE2  (via drill 0.36)
  Top 0.254: JP7.1 45.8,22.94 47.9,22.94 48.39,23.42 48.39,29.03 48.21,29.21 44.02,29.21 42.47,30.76 v41.96,30.76 | v11.23,38.38 11.91,37.69 IC10.1
  Bottom 0.254: v41.96,30.76 40.95,31.77 33.35,31.77 31.19,33.93 17.42,33.93 12.98,38.38 v11.23,38.38
PWR_OE3  (via drill 0.36)
  Top 0.254: IC9.19 18.15,28.89 v18.16,28.88
  Bottom 0.254: v18.16,28.88 20.37,26.67 40.36,26.67 44.17,30.48 JP6.1
PWR_OE4  (via drill 0.36)
  Top 0.254: IC10.19 11.26,28.97 12.06,28.17 12.06,26.36 13.44,24.99 13.97,24.99 v14.1,24.87 | v28.98,24.99 35.26,31.27 37.01,33.02 JP5.1
  Bottom 0.254: v28.98,24.99 28.85,24.87 v14.1,24.87
VDD  (via drill 0.36)
  Top 0.254: C21.1 4.45,1.42 4.67,1.02 7.24,1.02 7.75,1.65 R9.2 7.72,2.3 v7.72,1.75 | IC6.4 16.3,4.98 v16.99,4.98 20.87,8.85 C24.1 C22.1 20.59,12.72 v19.99,12.72 | v27.13,12.17 27.56,11.73 C213.1 | IC11.14 30.63,6.93 30.86,6.93 v30.99,7.06 | v28.37,9.17 28.37,10.04 C205.1 28.41,10.08 C213.1 | C213.1 28.56,11.89 U201.1 30.53,13.78 30.53,18.77 | 30.53,18.77 30.87,19.11 IC202.18 | 16.03,27.99 13.08,27.99 12.72,28.35 11.91,29.16 IC10.20 11.91,34.65 12.42,35.15 12.42,38.25 11.43,39.24 11.43,40.95 9.91,42.47 | 16.03,27.99 18.57,27.99 18.8,28.22 IC9.20 19,30.12 v20.83,30.12 | 30.53,18.77 30.53,19.63 v30.33,19.84 | v29.95,23.24 31.14,24.43 v31.14,25.45 | v16.28,28.55 16.03,28.3 16.03,27.99 | 23.95,35.48 23.95,35.46 v23.93,35.43 23.93,30.53 v23.55,30.15 | 23.95,35.48 IC3.1 23.95,35.48 | 23.95,35.48 25.22,35.48 25.86,36.12 IC3.3 | v34.24,36.09 34.29,36.14 C38.+ 34.31,38.58 38.63,38.58 41.66,35.56 JP15.1 | 9.91,42.47 C37.+ | 9.91,42.47 12.08,42.47 C44.1 C23.1 C46.1
  Bottom 0.254: v7.72,1.75 7.72,1.88 10.82,4.98 v16.99,4.98 | v19.99,12.72 20.55,12.17 v27.13,12.17 | v28.37,9.17 28.88,9.17 v30.99,7.06 | v30.33,19.84 29.95,20.22 v29.95,23.24 | v31.14,25.45 30.5,26.09 17.27,26.09 16.28,27.08 v16.28,28.55 | v20.83,30.12 20.85,30.15 v23.55,30.15 | v34.24,36.09 24.59,36.09 v23.93,35.43
VMID  (via drill 0.36)
  Top 0.254: R38.1 4.38,8.1 R17.1 R36.1 2.7,8.13 1.78,8.13 1.52,7.87 1.52,4.32 1.82,4.03 C45.1 2.79,3.3 3.1,3.17 5.89,3.17 6.1,3.3 | 6.1,3.3 C10.1 | 6.1,3.3 6.22,3.17 10.54,3.17 11.05,2.67 | 11.05,2.67 R13.1 | 11.05,2.67 11.56,3.17 13.31,3.17 14.12,3.99 14.12,6.1 14.31,6.28 IC6.2 IC6.1 15.29,6.99 v15.29,7.37 | v16.03,13.61 16.89,14.48 R12.1 | R19.1 32.35,5.99 v32.36,6.43
  Bottom 0.254: 16.03,8.1 v15.29,7.37 16.03,8.1 | 16.03,8.1 v16.03,13.61 | 16.03,8.1 28.73,8.1 30.4,6.43 v32.36,6.43

### Text on the board
tPlace: NSL | [ | ]
bStop: J. Westhues | proxmark3